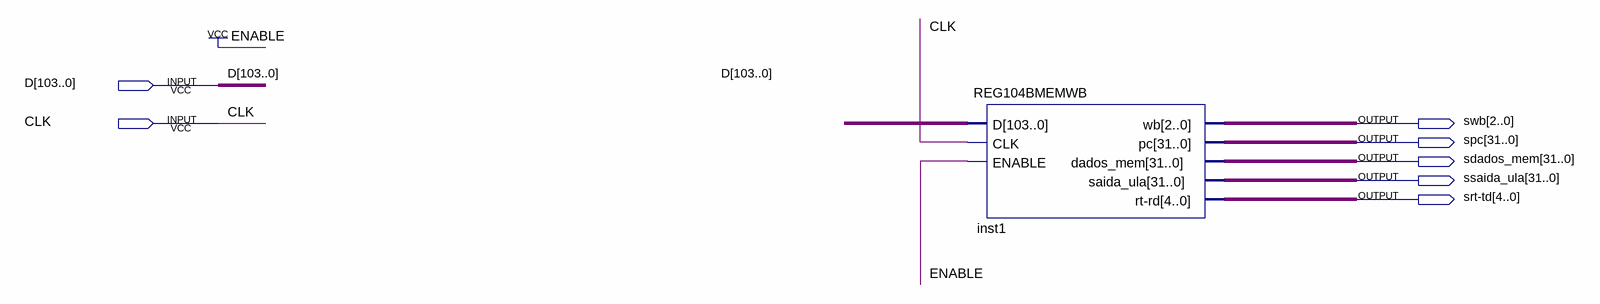
[diagram p0: schematic sheet]
// Quartus schematic MEM-WB.bdf as structural Verilog: 1 symbols, 7 pins
module \MEM-WB  (
  input  [103:0] D,
  input  CLK,
  output [2:0] swb,
  output [31:0] spc,
  output [31:0] sdados_mem,
  output [31:0] ssaida_ula,
  output [4:0] \srt-td 
);

  REG104BMEMWB inst1 (
    .D(D), .CLK(CLK), .ENABLE(1'b1), .wb(swb), .pc(spc), .dados_mem(sdados_mem), .saida_ula(ssaida_ula),
    .\rt-rd (\srt-td ));
endmodule
